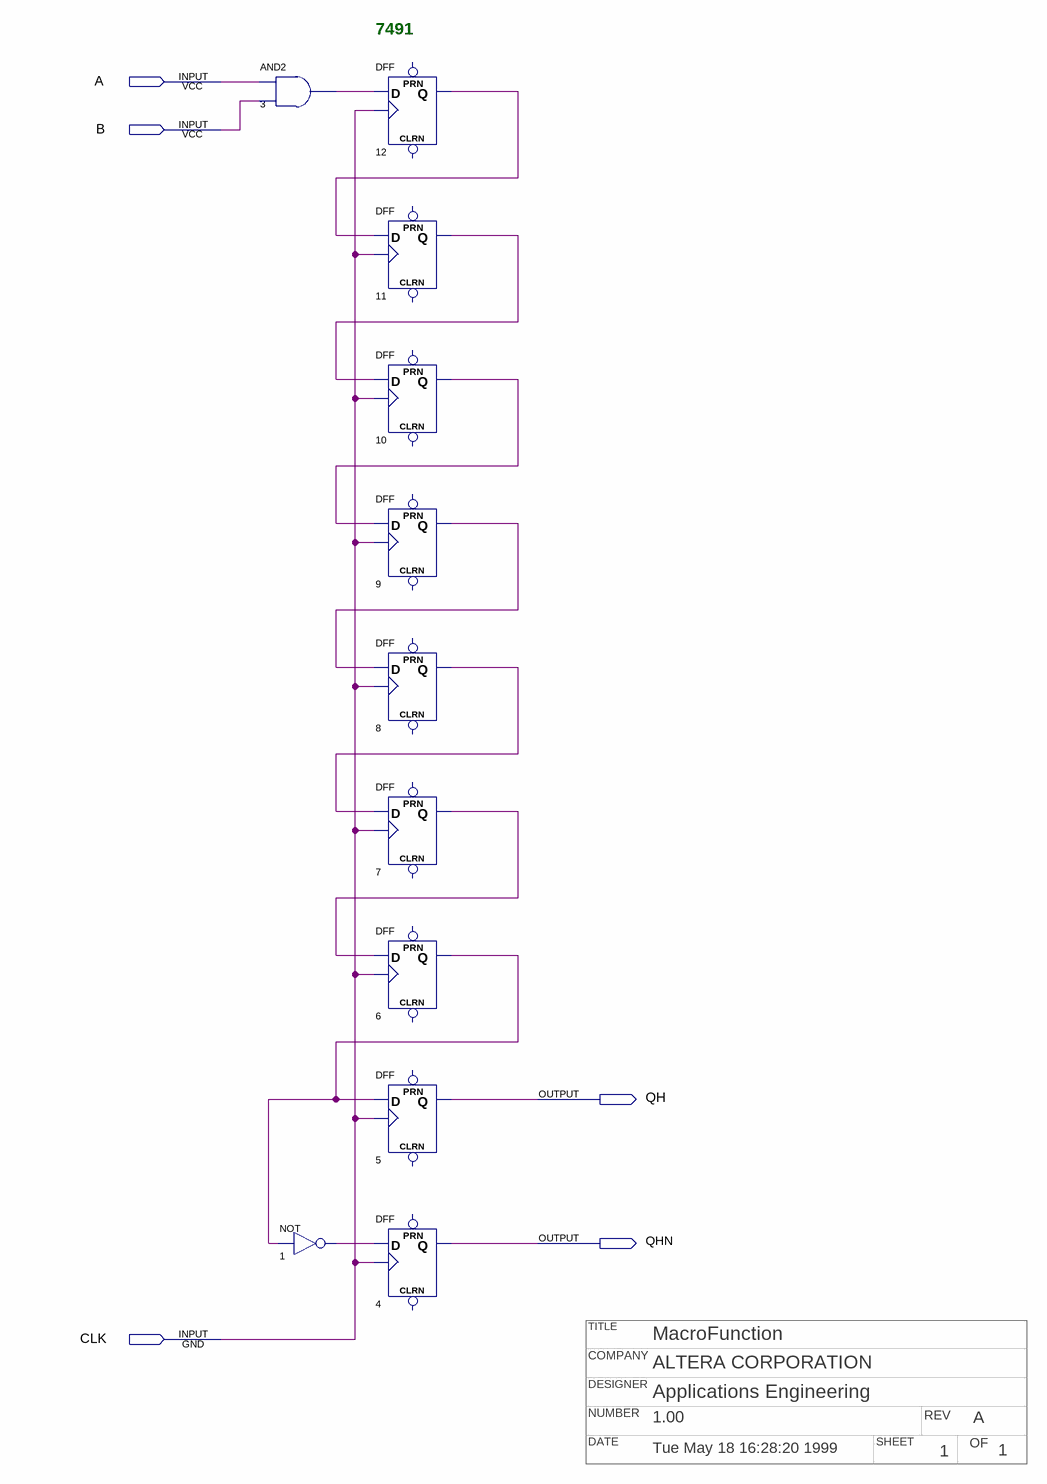
[diagram p0: schematic sheet]
// Quartus schematic 7491.bdf as structural Verilog: 11 symbols, 5 pins
// Title block: TITLE: MacroFunction; COMPANY: ALTERA CORPORATION; DESIGNER: Applications Engineering; NUMBER: 1.00; REV: A; DATE: Tue May 18 16:28:20 1999; SHEET: 1; OF: 1
module \7491  (
  input  A,
  input  B,
  input  CLK,
  output QH,
  output QHN
);

  wire n1_out, n3_out, n6_q, n7_q, n8_q, n9_q, n10_q, n11_q, n12_q;

  and u_3 (n3_out, A, B);
  not u_1 (n1_out, n6_q);
  DFF u_12 (.CLK(CLK), .D(n3_out), .Q(n12_q));  // open: CLRN, PRN
  DFF u_11 (.CLK(CLK), .D(n12_q), .Q(n11_q));  // open: CLRN, PRN
  DFF u_10 (.CLK(CLK), .D(n11_q), .Q(n10_q));  // open: CLRN, PRN
  DFF u_9 (.CLK(CLK), .D(n10_q), .Q(n9_q));  // open: CLRN, PRN
  DFF u_8 (.CLK(CLK), .D(n9_q), .Q(n8_q));  // open: CLRN, PRN
  DFF u_7 (.CLK(CLK), .D(n8_q), .Q(n7_q));  // open: CLRN, PRN
  DFF u_6 (.CLK(CLK), .D(n7_q), .Q(n6_q));  // open: CLRN, PRN
  DFF u_5 (.CLK(CLK), .D(n6_q), .Q(QH));  // open: CLRN, PRN
  DFF u_4 (.CLK(CLK), .D(n1_out), .Q(QHN));  // open: CLRN, PRN

  // Notes on the sheet:
  //   7491
endmodule
